# Altium schematic sheet Control.SchDoc
size A4; DocumentNumber: 2; SheetNumber: 2; SheetTotal: 2
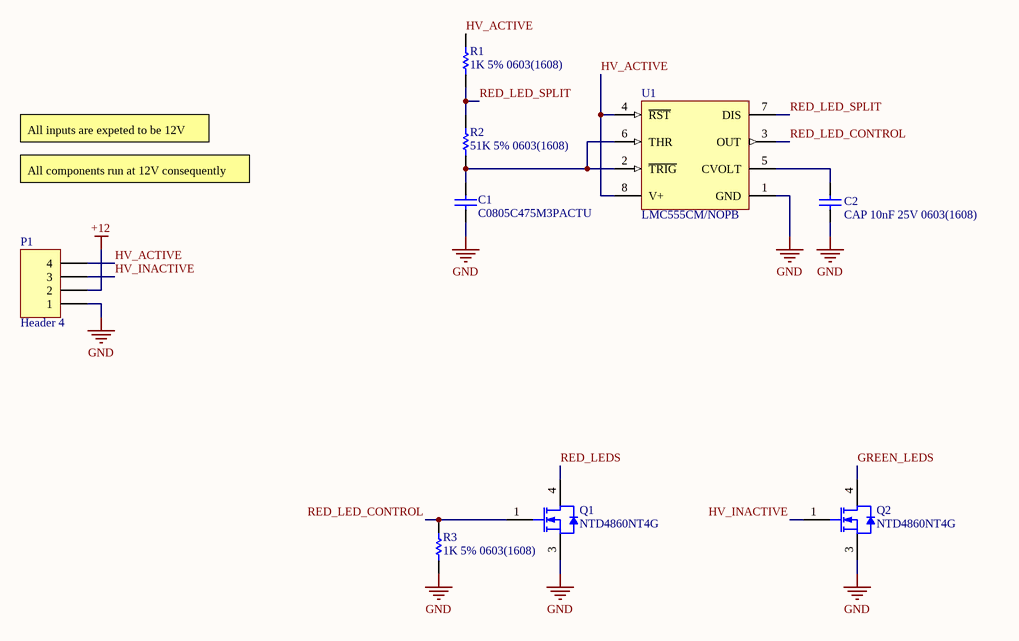
[diagram p0: Control.SchDoc]

## Parts
C1  C0805C475M3PACTU  [CAPC2013X145X50NL20T25]
C2  CAP 10nF 25V 0603(1608)  [CAPC0603(1608)100_M]
P1  Header 4  [HDR1X4]
Q1  NTD4860NT4G  [ONSC-DPAK-3-369AA-01_V]
Q2  NTD4860NT4G  [ONSC-DPAK-3-369AA-01_V]
R1  1K 5% 0603(1608)  [RESC0603(1608)_L]
R2  51K 5% 0603(1608)  [RESC0603(1608)_M]
R3  1K 5% 0603(1608)  [RESC0603(1608)_L]
U1  LMC555CM/NOPB  [D0008A_L]

## Nets
+12: P1.2
GND: C1.1 C2.1 P1.1 Q1.3(S) Q2.3(S) R3.1 U1.1(GND)
GREEN_LEDS: Q2.4(D)
HV_ACTIVE: P1.4 R1.2 U1.4(~{RST}) U1.8(V+)
HV_INACTIVE: P1.3 Q2.1(G)
RED_LED_CONTROL: Q1.1(G) R3.2 U1.3(OUT)
RED_LED_SPLIT: R1.1 R2.2 U1.7(DIS)
RED_LEDS: Q1.4(D)
NetC1_2: C1.2 R2.1 U1.2(~{TRIG}) U1.6(THR)
NetC2_2: C2.2 U1.5(CVOLT)

## Notes on the sheet
- All inputs are expeted to be 12V
- All components run at 12V consequently

## Library data of the parts
C1 = CMP-2007-01014-1: Manufacturer: Kemet; Part Number: C0805C475M3PACTU
C2 = CMP-1035-02316-1: CAP 10nF 25V ±5% 0603 (1608 Metric) Thickness 1mm SMD; Tolerance: Â±5%; Case-EIA: 0603; Case-Metric: 1608; Rated Voltage: 25 V; Technology: SMT; Max Thickness: 1 mm; Value: 10nF
P1 = Header 4: Header, 4-Pin; LatestRevisionDate: 17-Jul-2002; LatestRevisionNote: Re-released for DXP Platform.; Publisher: Altium Limited
Q1 Q2 = CMP-1058-00321-1: Power MOSFET, 25 V, 65 A, Single N-Channel, 3-Pin DPAK, Pb-Free, Tape and Reel; Manufacturer: On Semiconductor; VGS Max (V): 20; Ciss Typ (pF): 1308; Coss Typ (pF): 342; Qrr Typ (nC): 3.5; VGS(th) Max (V): 2.5; Channel Polarity: N Channel; V(BR)DSS Min (V): 25; ID Max (A): 65; Crss Typ (pF): 169; ComponentLink1Description: Manufacturer URL; Configuration: Single; ComponentLink2Description: Datasheet; DatasheetVersion: Rev. 1; PackageDescription: 3-Pin Flange Mount, Body 6.54 x 6.095 mm, Pitch 2.29 mm; PartNumber: NTD4860NT4G; Packing: Tape and Reel; ComponentLink3URL: http://www.onsemi.cn/pub_link/Collateral/369AA.PDF; Package Type: DPAK-3; PackageReference: DPAK-3-369AA-01; ComponentLink2URL: http://www.onsemi.cn/pub_link/Collateral/NTD4860N.PDF; Mounting Technology: Surface Mount; RoHS: Pb-Free; ComponentLink1URL: http://www.onsemi.com/; PackageVersion: Rev. B, 06/2010; ComponentLink3Description: Package Specification
R1 R3 = CMP-1012-00074-1: 1K 0.1W 5% 0603 (1608 Metric)  SMD; Case-EIA: 0603; Case-Metric: 1608; Value: 1000.00 Ohm; Technology: SMT; Tolerance: 5 %; Power: 0.1 W
R2 = CMP-1012-00115-1: 51K 0.1W 5% 0603 (1608 Metric)  SMD; Case-EIA: 0603; Case-Metric: 1608; Value: 51000.00 Ohm; Power: 0.1 W; Technology: SMT; Tolerance: 5 %
U1 = CMP-0056-00124-3: CMOS Timer, 8-pin Narrow SOIC, Pb-Free; Manufacturer: Texas Instruments; PackageTopMarking: NSZXTT*LMC*555CM; PowerWise: N; CompType: Analog IC; RoHS: Y; ComponentLink1Description: Datasheet URL; ComponentLink1URL: http://www.ti.com/general/docs/lit/getliterature.tsp?genericPartNumber=LMC555&fileType=pdf; Code_JEDEC: MS-012-AA; PackageDescription: SOIC Narrow, 4.9 x 3.9 x 1.45mm, 8 Lead, 1.27mm Pitch; Code_IPC: SOIC127P600-8; PinCount: 8; PackageReference: D0008A